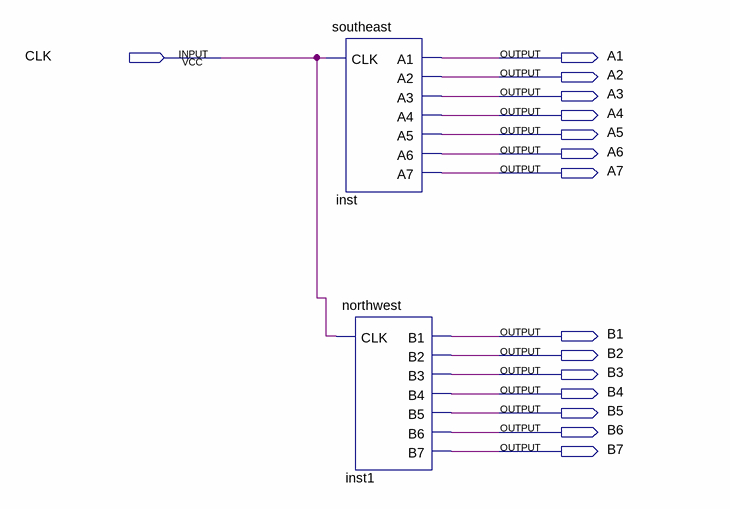
[diagram p0: schematic sheet]
// Quartus schematic lamp.bdf as structural Verilog: 2 symbols, 15 pins
module lamp (
  input  CLK,
  output A1,
  output A2,
  output A3,
  output A4,
  output A5,
  output A6,
  output A7,
  output B1,
  output B2,
  output B3,
  output B4,
  output B5,
  output B6,
  output B7
);

  southeast inst (.CLK(CLK), .A1(A1), .A2(A2), .A3(A3), .A4(A4), .A5(A5), .A6(A6), .A7(A7));
  northwest inst1 (.CLK(CLK), .B1(B1), .B2(B2), .B3(B3), .B4(B4), .B5(B5), .B6(B6), .B7(B7));
endmodule
